# Altium schematic sheet Backpage.SchDoc: uInverter Backpage
size Letter; Engineer: Parth Purohit; Revision: B; SheetNumber: 3; SheetTotal: 3
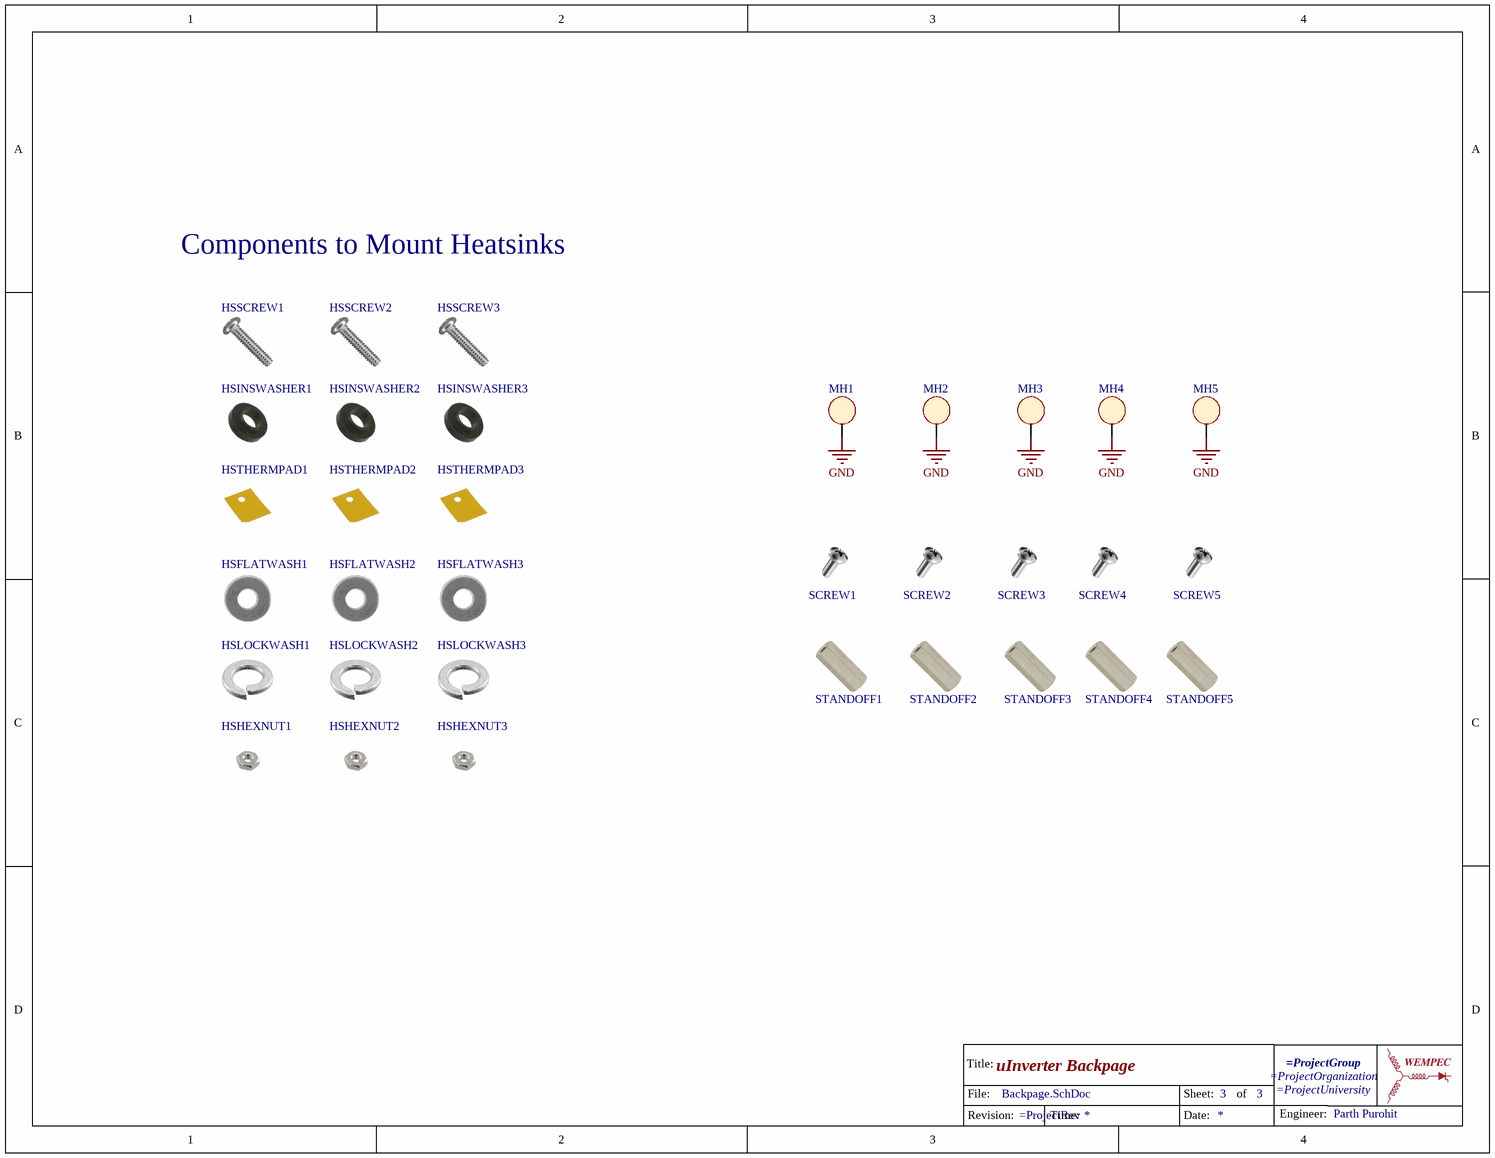
[diagram p0: Backpage.SchDoc]

## Parts
HSFLATWASH1  FWSS 004  (value not drawn)
HSFLATWASH2  FWSS 004  (value not drawn)
HSFLATWASH3  FWSS 004  (value not drawn)
HSHEXNUT1  HNZ 440  (value not drawn)
HSHEXNUT2  HNZ 440  (value not drawn)
HSHEXNUT3  HNZ 440  (value not drawn)
HSINSWASHER1  7721-7PPSG  (value not drawn)
HSINSWASHER2  7721-7PPSG  (value not drawn)
HSINSWASHER3  7721-7PPSG  (value not drawn)
HSLOCKWASH1  4693  (value not drawn)
HSLOCKWASH2  4693  (value not drawn)
HSLOCKWASH3  4693  (value not drawn)
HSSCREW1  PMSSS4400050PH  (value not drawn)
HSSCREW2  PMSSS4400050PH  (value not drawn)
HSSCREW3  PMSSS4400050PH  (value not drawn)
HSTHERMPAD1  43-77-9G  (value not drawn)
HSTHERMPAD2  43-77-9G  (value not drawn)
HSTHERMPAD3  43-77-9G  (value not drawn)
MH1  MOUNT_HOLE  [MOUNTING_HOLE]  (value not drawn)  (no BOM)
MH2  MOUNT_HOLE  [MOUNTING_HOLE]  (value not drawn)  (no BOM)
MH3  MOUNT_HOLE  [MOUNTING_HOLE]  (value not drawn)  (no BOM)
MH4  MOUNT_HOLE  [MOUNTING_HOLE]  (value not drawn)  (no BOM)
MH5  MOUNT_HOLE  [MOUNTING_HOLE]  (value not drawn)  (no BOM)
SCREW1  Screw-4-40  (value not drawn)
SCREW2  Screw-4-40  (value not drawn)
SCREW3  Screw-4-40  (value not drawn)
SCREW4  Screw-4-40  (value not drawn)
SCREW5  Screw-4-40  (value not drawn)
STANDOFF1  Standoff-4-40  (value not drawn)
STANDOFF2  Standoff-4-40  (value not drawn)
STANDOFF3  Standoff-4-40  (value not drawn)
STANDOFF4  Standoff-4-40  (value not drawn)
STANDOFF5  Standoff-4-40  (value not drawn)
TitleBlockWEMPEC3  TitleBlockWEMPEC  (value not drawn)  (graphical)

## Nets
GND: MH1.1 MH2.1 MH3.1 MH4.1 MH5.1

## Notes on the sheet
- Components to Mount Heatsinks
- (in symbol TitleBlockWEMPEC) Title:; File:; Sheet:; of; Engineer:; Revision:; Time:; Date:

## Library data of the parts
HSFLATWASH1-HSFLATWASH3 = FWSS 004: WASHER FLAT #4 STAINLESS STEEL; Manufacturer: B&F Fastener Supply; Supplier Part Number 1: H734-ND; Supplier 1: Digi-Key; Manufacturer Part Number: FWSS 004
HSHEXNUT1-HSHEXNUT3 = HNZ 440: HEX NUT 1/4in 4-40; Manufacturer: B&F Fastener Supply; Supplier Part Number 1: H216-ND; Supplier 1: Digi-Key; Manufacturer Part Number: HNZ 440
HSINSWASHER1-HSINSWASHER3 = 7721-7PPSG: WASHER SHOULDER #4 POLY SULFIDE; Manufacturer: Boyd Laconia, LLC; Supplier Part Number 1: HS418-ND; Supplier 1: Digi-Key; Manufacturer Part Number: 7721-7PPSG
HSLOCKWASH1-HSLOCKWASH3 = 4693: WASHER SPLIT LOCK #4 STEEL; Manufacturer: Keystone Electronics; Supplier Part Number 1: 36-4693-ND; Supplier 1: DIgi-Key; Manufacturer Part Number: 4693
HSSCREW1-HSSCREW3 = PMSSS4400050PH: MACHINE SCREW PAN PHILLIPS 4-40; Manufacturer: B&F Fastener Supply; Supplier Part Number 1: H705-ND; Supplier 1: Digi-Key; Manufacturer Part Number: PMSSS 440 0050 PH
HSTHERMPAD1-HSTHERMPAD3 = 43-77-9G: THERM PAD 18.42MMX13.21MM AMBER; Manufacturer: Boyd Laconia, LLC; Supplier Part Number 1: 43-77-9G-ND; Supplier 1: Digi-Key; Manufacturer Part number: 43-77-9G
MH1-MH5 = MOUNT_HOLE: MOUNTING HOLE
SCREW1-SCREW5 = Screw-4-40: MACH SCREW PAN PHILLIPS #4-40; Manufacturer Part Number: 9900; Manufacturer: Keystone Electronics; Supplier 1: Digi-Key; Supplier Part Number 1: 36-9900-ND
STANDOFF1-STANDOFF5 = Standoff-4-40: HEX STANDOFF #4-40 BRASS 1/2"; Manufacturer Part Number: 1656; Manufacturer: Keystone Electronics; Supplier 1: Digi-Key; Supplier Part Number 1: 36-1656-ND